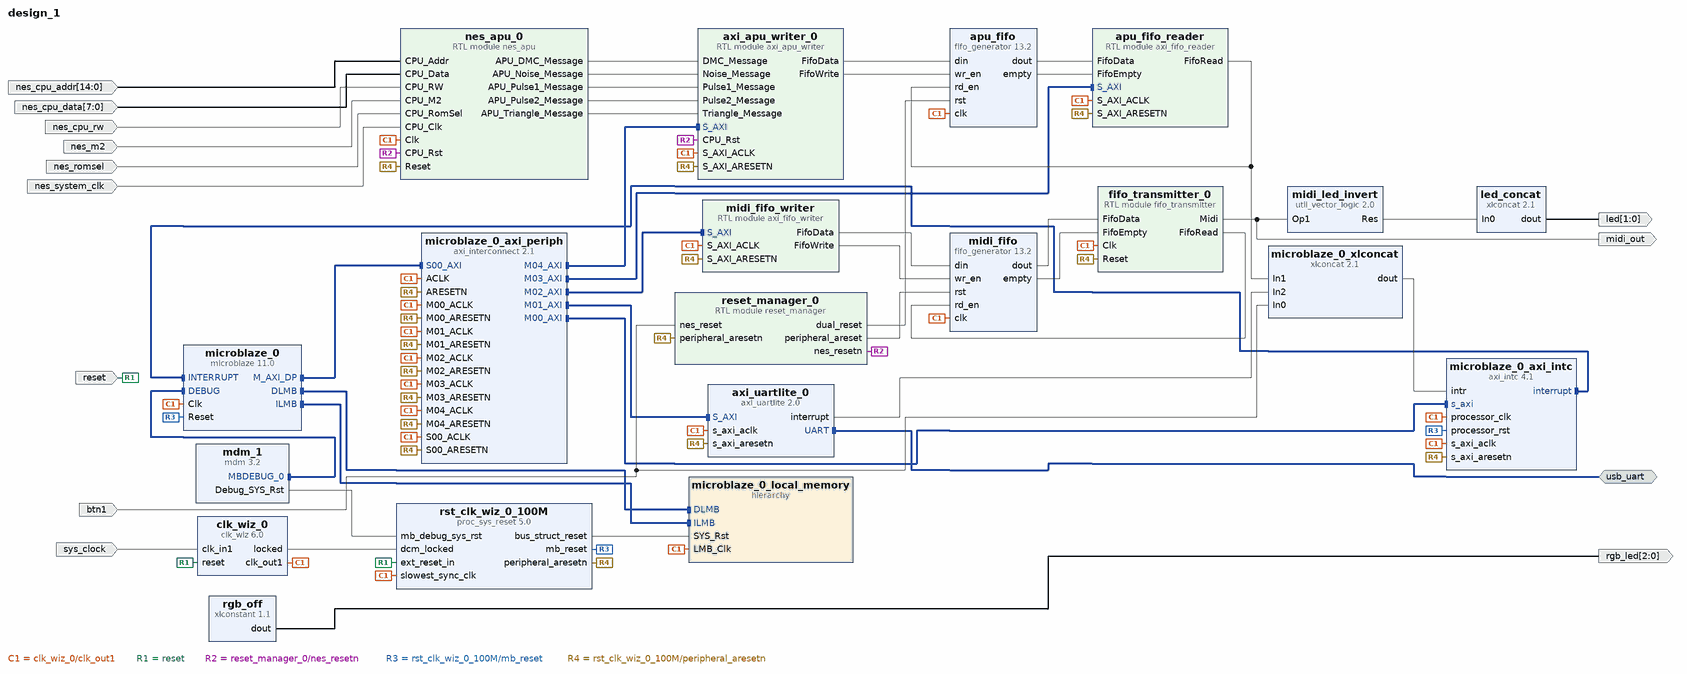
[diagram p0: block diagram of the top level]
# Vivado block design design_1, xc7a35tcpg236-1, Vivado 2022.2.2
create_bd_design design_1

create_bd_intf_port -mode Master -vlnv xilinx.com:interface:uart_rtl:1.0 usb_uart
create_bd_port -dir O -from 2 -to 0 rgb_led
create_bd_port -dir O -from 1 -to 0 led
create_bd_port -dir I -from 14 -to 0 nes_cpu_addr
create_bd_port -dir I -from 7 -to 0 nes_cpu_data
create_bd_port -dir I nes_cpu_rw
create_bd_port -dir I nes_romsel
create_bd_port -dir I -type clk nes_system_clk
set_property -dict {CONFIG.FREQ_HZ 21477272} [get_bd_ports nes_system_clk]
create_bd_port -dir O midi_out
create_bd_port -dir I -type clk nes_m2
set_property -dict {CONFIG.FREQ_HZ 1789773} [get_bd_ports nes_m2]
create_bd_port -dir I btn1
create_bd_port -dir I -type clk sys_clock
set_property -dict {CONFIG.FREQ_HZ 12000000 CONFIG.PHASE 0.0} [get_bd_ports sys_clock]
create_bd_port -dir I -type rst reset
set_property -dict {CONFIG.POLARITY ACTIVE_HIGH} [get_bd_ports reset]

create_bd_cell -type ip -vlnv xilinx.com:ip:xlconstant:1.1 rgb_off
set_property -dict {CONFIG.CONST_VAL 7 CONFIG.CONST_WIDTH 3} [get_bd_cells rgb_off]
create_bd_cell -type ip -vlnv xilinx.com:ip:xlconcat:2.1 led_concat
set_property -dict {CONFIG.IN0_WIDTH 1 CONFIG.IN1_WIDTH 1} [get_bd_cells led_concat]
create_bd_cell -type ip -vlnv xilinx.com:ip:clk_wiz:6.0 clk_wiz_0
set_property -dict [list \
  CONFIG.CLK_IN1_BOARD_INTERFACE sys_clock \
  CONFIG.RESET_BOARD_INTERFACE reset \
  CONFIG.USE_BOARD_FLOW true \
] [get_bd_cells clk_wiz_0]
create_bd_cell -type ip -vlnv xilinx.com:ip:proc_sys_reset:5.0 rst_clk_wiz_0_100M
set_property -dict {CONFIG.RESET_BOARD_INTERFACE reset CONFIG.USE_BOARD_FLOW true} [get_bd_cells rst_clk_wiz_0_100M]
create_bd_cell -type ip -vlnv xilinx.com:ip:util_vector_logic:2.0 midi_led_invert
set_property -dict {CONFIG.C_OPERATION not CONFIG.C_SIZE 1} [get_bd_cells midi_led_invert]
create_bd_cell -type module -reference reset_manager reset_manager_0
create_bd_cell -type module -reference axi_fifo_reader apu_fifo_reader
set_property -dict {CONFIG.FIFO_DATA_WIDTH 28} [get_bd_cells apu_fifo_reader]
create_bd_cell -type ip -vlnv xilinx.com:ip:fifo_generator:13.2 apu_fifo
set_property -dict [list \
  CONFIG.Enable_Safety_Circuit false \
  CONFIG.Input_Data_Width 28 \
  CONFIG.Reset_Type Asynchronous_Reset \
] [get_bd_cells apu_fifo]
create_bd_cell -type ip -vlnv xilinx.com:ip:axi_intc:4.1 microblaze_0_axi_intc
set_property -dict {CONFIG.C_HAS_FAST 1} [get_bd_cells microblaze_0_axi_intc]
create_bd_cell -type ip -vlnv xilinx.com:ip:mdm:3.2 mdm_1
create_bd_cell -type ip -vlnv xilinx.com:ip:microblaze:11.0 microblaze_0
set_property -dict [list \
  CONFIG.C_DEBUG_ENABLED 1 \
  CONFIG.C_D_AXI 1 \
  CONFIG.C_D_LMB 1 \
  CONFIG.C_I_LMB 1 \
  CONFIG.C_USE_DIV 1 \
  CONFIG.C_USE_FPU 1 \
  CONFIG.C_USE_HW_MUL 1 \
] [get_bd_cells microblaze_0]
create_bd_cell -type ip -vlnv xilinx.com:ip:axi_uartlite:2.0 axi_uartlite_0
set_property -dict [list \
  CONFIG.C_BAUDRATE 230400 \
  CONFIG.UARTLITE_BOARD_INTERFACE usb_uart \
  CONFIG.USE_BOARD_FLOW true \
] [get_bd_cells axi_uartlite_0]
create_bd_cell -type ip -vlnv xilinx.com:ip:xlconcat:2.1 microblaze_0_xlconcat
set_property -dict {CONFIG.NUM_PORTS 3} [get_bd_cells microblaze_0_xlconcat]
create_bd_cell -type ip -vlnv xilinx.com:ip:axi_interconnect:2.1 microblaze_0_axi_periph
set_property -dict {CONFIG.NUM_MI 5} [get_bd_cells microblaze_0_axi_periph]
create_bd_cell -type hier microblaze_0_local_memory
create_bd_cell -type module -reference axi_fifo_writer midi_fifo_writer
set_property -dict {CONFIG.FIFO_DATA_WIDTH 26} [get_bd_cells midi_fifo_writer]
create_bd_cell -type ip -vlnv xilinx.com:ip:fifo_generator:13.2 midi_fifo
set_property -dict [list \
  CONFIG.Data_Count false \
  CONFIG.Enable_Safety_Circuit false \
  CONFIG.Input_Data_Width 26 \
  CONFIG.Reset_Type Asynchronous_Reset \
  CONFIG.Use_Embedded_Registers false \
  CONFIG.Write_Acknowledge_Flag false \
] [get_bd_cells midi_fifo]
create_bd_cell -type module -reference fifo_transmitter fifo_transmitter_0
create_bd_cell -type module -reference axi_apu_writer axi_apu_writer_0
set_property -dict [list \
  CONFIG.DEFAULT_DMC false \
  CONFIG.DEFAULT_NOISE true \
  CONFIG.DEFAULT_PULSE_1 true \
  CONFIG.FIFO_DATA_WIDTH 28 \
] [get_bd_cells axi_apu_writer_0]
create_bd_cell -type module -reference nes_apu nes_apu_0

# ---- hierarchy /microblaze_0_local_memory ----
current_bd_instance /microblaze_0_local_memory
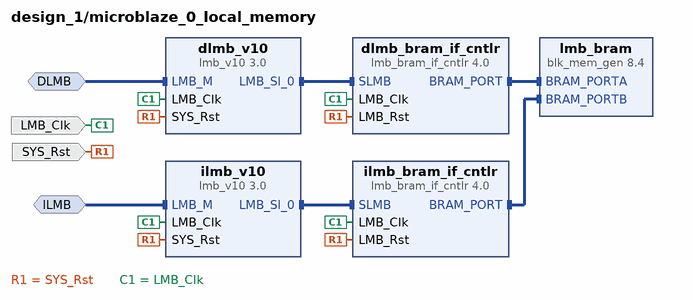
[diagram p1: block diagram inside /microblaze_0_local_memory]
create_bd_intf_pin -mode MirroredMaster -vlnv xilinx.com:interface:lmb_rtl:1.0 DLMB
create_bd_intf_pin -mode MirroredMaster -vlnv xilinx.com:interface:lmb_rtl:1.0 ILMB
create_bd_pin -dir I -type clk LMB_Clk
create_bd_pin -dir I -type rst SYS_Rst

create_bd_cell -type ip -vlnv xilinx.com:ip:lmb_v10:3.0 dlmb_v10
create_bd_cell -type ip -vlnv xilinx.com:ip:lmb_v10:3.0 ilmb_v10
create_bd_cell -type ip -vlnv xilinx.com:ip:lmb_bram_if_cntlr:4.0 dlmb_bram_if_cntlr
set_property -dict {CONFIG.C_ECC 0} [get_bd_cells dlmb_bram_if_cntlr]
create_bd_cell -type ip -vlnv xilinx.com:ip:lmb_bram_if_cntlr:4.0 ilmb_bram_if_cntlr
set_property -dict {CONFIG.C_ECC 0} [get_bd_cells ilmb_bram_if_cntlr]
create_bd_cell -type ip -vlnv xilinx.com:ip:blk_mem_gen:8.4 lmb_bram
set_property -dict {CONFIG.Memory_Type True_Dual_Port_RAM CONFIG.use_bram_block BRAM_Controller} [get_bd_cells lmb_bram]

# ---- connections ----

current_bd_instance /microblaze_0_local_memory
connect_bd_intf_net -intf_net microblaze_0_dlmb [get_bd_intf_pins DLMB] [get_bd_intf_pins dlmb_v10/LMB_M]
connect_bd_intf_net -intf_net microblaze_0_dlmb_bus [get_bd_intf_pins dlmb_v10/LMB_Sl_0] [get_bd_intf_pins dlmb_bram_if_cntlr/SLMB]
connect_bd_intf_net -intf_net microblaze_0_dlmb_cntlr [get_bd_intf_pins dlmb_bram_if_cntlr/BRAM_PORT] [get_bd_intf_pins lmb_bram/BRAM_PORTA]
connect_bd_intf_net -intf_net microblaze_0_ilmb [get_bd_intf_pins ILMB] [get_bd_intf_pins ilmb_v10/LMB_M]
connect_bd_intf_net -intf_net microblaze_0_ilmb_bus [get_bd_intf_pins ilmb_v10/LMB_Sl_0] [get_bd_intf_pins ilmb_bram_if_cntlr/SLMB]
connect_bd_intf_net -intf_net microblaze_0_ilmb_cntlr [get_bd_intf_pins ilmb_bram_if_cntlr/BRAM_PORT] [get_bd_intf_pins lmb_bram/BRAM_PORTB]
connect_bd_net [get_bd_pins SYS_Rst] \
  [get_bd_pins dlmb_v10/SYS_Rst] [get_bd_pins dlmb_bram_if_cntlr/LMB_Rst] [get_bd_pins ilmb_v10/SYS_Rst] \
  [get_bd_pins ilmb_bram_if_cntlr/LMB_Rst]
connect_bd_net -net microblaze_0_Clk [get_bd_pins LMB_Clk] \
  [get_bd_pins dlmb_v10/LMB_Clk] [get_bd_pins dlmb_bram_if_cntlr/LMB_Clk] [get_bd_pins ilmb_v10/LMB_Clk] \
  [get_bd_pins ilmb_bram_if_cntlr/LMB_Clk]
set_property HDL_ATTRIBUTE.BMM_INFO_ADDRESS_SPACE {byte  0x00000000 32 > design_1 microblaze_0_local_memory/lmb_bram} [get_bd_cells dlmb_bram_if_cntlr]
set_property HDL_ATTRIBUTE.KEEP_HIERARCHY yes [get_bd_cells dlmb_bram_if_cntlr]

current_bd_instance /
connect_bd_intf_net [get_bd_intf_ports usb_uart] [get_bd_intf_pins axi_uartlite_0/UART]
connect_bd_intf_net -intf_net microblaze_0_axi_dp [get_bd_intf_pins microblaze_0_axi_periph/S00_AXI] [get_bd_intf_pins microblaze_0/M_AXI_DP]
connect_bd_intf_net [get_bd_intf_pins microblaze_0_axi_periph/M01_AXI] [get_bd_intf_pins axi_uartlite_0/S_AXI]
connect_bd_intf_net [get_bd_intf_pins microblaze_0_axi_periph/M02_AXI] [get_bd_intf_pins midi_fifo_writer/S_AXI]
connect_bd_intf_net [get_bd_intf_pins microblaze_0_axi_periph/M03_AXI] [get_bd_intf_pins apu_fifo_reader/S_AXI]
connect_bd_intf_net [get_bd_intf_pins microblaze_0_axi_periph/M04_AXI] [get_bd_intf_pins axi_apu_writer_0/S_AXI]
connect_bd_intf_net [get_bd_intf_pins mdm_1/MBDEBUG_0] [get_bd_intf_pins microblaze_0/DEBUG]
connect_bd_intf_net [get_bd_intf_pins microblaze_0/DLMB] [get_bd_intf_pins microblaze_0_local_memory/DLMB]
connect_bd_intf_net [get_bd_intf_pins microblaze_0/ILMB] [get_bd_intf_pins microblaze_0_local_memory/ILMB]
connect_bd_intf_net -intf_net microblaze_0_intc_axi [get_bd_intf_pins microblaze_0_axi_periph/M00_AXI] [get_bd_intf_pins microblaze_0_axi_intc/s_axi]
connect_bd_intf_net [get_bd_intf_pins microblaze_0_axi_intc/interrupt] [get_bd_intf_pins microblaze_0/INTERRUPT]
connect_bd_net [get_bd_pins apu_fifo/dout] [get_bd_pins apu_fifo_reader/FifoData]
connect_bd_net [get_bd_pins apu_fifo/empty] [get_bd_pins apu_fifo_reader/FifoEmpty]
connect_bd_net [get_bd_pins apu_fifo_reader/FifoRead] [get_bd_pins apu_fifo/rd_en] [get_bd_pins microblaze_0_xlconcat/In1]
connect_bd_net [get_bd_pins axi_apu_writer_0/FifoData] [get_bd_pins apu_fifo/din]
connect_bd_net [get_bd_pins axi_apu_writer_0/FifoWrite] [get_bd_pins apu_fifo/wr_en]
connect_bd_net -net axi_fifo_writer_0_FifoData [get_bd_pins midi_fifo_writer/FifoData] [get_bd_pins midi_fifo/din]
connect_bd_net -net axi_fifo_writer_0_FifoWrite [get_bd_pins midi_fifo_writer/FifoWrite] [get_bd_pins midi_fifo/wr_en]
connect_bd_net [get_bd_pins axi_uartlite_0/interrupt] [get_bd_pins microblaze_0_xlconcat/In2]
connect_bd_net -net btn1_1 [get_bd_ports btn1] [get_bd_pins reset_manager_0/nes_reset] [get_bd_pins microblaze_0_xlconcat/In0]
connect_bd_net [get_bd_pins clk_wiz_0/locked] [get_bd_pins rst_clk_wiz_0_100M/dcm_locked]
connect_bd_net -net fifo_generator_0_dout [get_bd_pins midi_fifo/dout] [get_bd_pins fifo_transmitter_0/FifoData]
connect_bd_net -net fifo_generator_0_empty [get_bd_pins midi_fifo/empty] [get_bd_pins fifo_transmitter_0/FifoEmpty]
connect_bd_net [get_bd_pins fifo_transmitter_0/FifoRead] [get_bd_pins midi_fifo/rd_en]
connect_bd_net [get_bd_pins fifo_transmitter_0/Midi] [get_bd_ports midi_out] [get_bd_pins midi_led_invert/Op1]
connect_bd_net [get_bd_pins mdm_1/Debug_SYS_Rst] [get_bd_pins rst_clk_wiz_0_100M/mb_debug_sys_rst]
connect_bd_net -net microblaze_0_Clk [get_bd_pins clk_wiz_0/clk_out1] \
  [get_bd_pins rst_clk_wiz_0_100M/slowest_sync_clk] [get_bd_pins apu_fifo/clk] [get_bd_pins apu_fifo_reader/S_AXI_ACLK] \
  [get_bd_pins axi_uartlite_0/s_axi_aclk] [get_bd_pins microblaze_0_axi_periph/M03_ACLK] \
  [get_bd_pins microblaze_0_axi_periph/M02_ACLK] [get_bd_pins microblaze_0_axi_periph/M01_ACLK] \
  [get_bd_pins microblaze_0_local_memory/LMB_Clk] [get_bd_pins microblaze_0_axi_intc/processor_clk] \
  [get_bd_pins microblaze_0_axi_periph/M00_ACLK] [get_bd_pins microblaze_0_axi_periph/S00_ACLK] \
  [get_bd_pins microblaze_0_axi_periph/ACLK] [get_bd_pins microblaze_0/Clk] [get_bd_pins microblaze_0_axi_intc/s_axi_aclk] \
  [get_bd_pins midi_fifo/clk] [get_bd_pins fifo_transmitter_0/Clk] [get_bd_pins midi_fifo_writer/S_AXI_ACLK] \
  [get_bd_pins microblaze_0_axi_periph/M04_ACLK] [get_bd_pins axi_apu_writer_0/S_AXI_ACLK] [get_bd_pins nes_apu_0/Clk]
connect_bd_net -net microblaze_0_intr [get_bd_pins microblaze_0_xlconcat/dout] [get_bd_pins microblaze_0_axi_intc/intr]
connect_bd_net [get_bd_pins nes_apu_0/APU_DMC_Message] [get_bd_pins axi_apu_writer_0/DMC_Message]
connect_bd_net [get_bd_pins nes_apu_0/APU_Noise_Message] [get_bd_pins axi_apu_writer_0/Noise_Message]
connect_bd_net [get_bd_pins nes_apu_0/APU_Pulse1_Message] [get_bd_pins axi_apu_writer_0/Pulse1_Message]
connect_bd_net [get_bd_pins nes_apu_0/APU_Pulse2_Message] [get_bd_pins axi_apu_writer_0/Pulse2_Message]
connect_bd_net [get_bd_pins nes_apu_0/APU_Triangle_Message] [get_bd_pins axi_apu_writer_0/Triangle_Message]
connect_bd_net [get_bd_ports nes_cpu_addr] [get_bd_pins nes_apu_0/CPU_Addr]
connect_bd_net [get_bd_ports nes_cpu_data] [get_bd_pins nes_apu_0/CPU_Data]
connect_bd_net [get_bd_ports nes_cpu_rw] [get_bd_pins nes_apu_0/CPU_RW]
connect_bd_net -net nes_m2_1 [get_bd_ports nes_m2] [get_bd_pins nes_apu_0/CPU_M2]
connect_bd_net [get_bd_ports nes_romsel] [get_bd_pins nes_apu_0/CPU_RomSel]
connect_bd_net [get_bd_ports nes_system_clk] [get_bd_pins nes_apu_0/CPU_Clk]
connect_bd_net [get_bd_ports reset] [get_bd_pins clk_wiz_0/reset] [get_bd_pins rst_clk_wiz_0_100M/ext_reset_in]
connect_bd_net [get_bd_pins reset_manager_0/dual_reset] [get_bd_pins apu_fifo/rst]
connect_bd_net [get_bd_pins reset_manager_0/nes_resetn] [get_bd_pins axi_apu_writer_0/CPU_Rst] [get_bd_pins nes_apu_0/CPU_Rst]
connect_bd_net [get_bd_pins reset_manager_0/peripheral_areset] [get_bd_pins midi_fifo/rst]
connect_bd_net [get_bd_pins rgb_off/dout] [get_bd_ports rgb_led]
connect_bd_net [get_bd_pins rst_clk_wiz_0_100M/bus_struct_reset] [get_bd_pins microblaze_0_local_memory/SYS_Rst]
connect_bd_net [get_bd_pins rst_clk_wiz_0_100M/mb_reset] [get_bd_pins microblaze_0/Reset] [get_bd_pins microblaze_0_axi_intc/processor_rst]
connect_bd_net [get_bd_pins rst_clk_wiz_0_100M/peripheral_aresetn] \
  [get_bd_pins reset_manager_0/peripheral_aresetn] [get_bd_pins apu_fifo_reader/S_AXI_ARESETN] \
  [get_bd_pins axi_uartlite_0/s_axi_aresetn] [get_bd_pins microblaze_0_axi_periph/M03_ARESETN] \
  [get_bd_pins microblaze_0_axi_periph/M02_ARESETN] [get_bd_pins microblaze_0_axi_periph/M01_ARESETN] \
  [get_bd_pins microblaze_0_axi_periph/M00_ARESETN] [get_bd_pins microblaze_0_axi_periph/S00_ARESETN] \
  [get_bd_pins microblaze_0_axi_periph/ARESETN] [get_bd_pins microblaze_0_axi_intc/s_axi_aresetn] \
  [get_bd_pins fifo_transmitter_0/Reset] [get_bd_pins midi_fifo_writer/S_AXI_ARESETN] \
  [get_bd_pins microblaze_0_axi_periph/M04_ARESETN] [get_bd_pins axi_apu_writer_0/S_AXI_ARESETN] \
  [get_bd_pins nes_apu_0/Reset]
connect_bd_net [get_bd_ports sys_clock] [get_bd_pins clk_wiz_0/clk_in1]
connect_bd_net -net util_vector_logic_0_Res1 [get_bd_pins midi_led_invert/Res] [get_bd_pins led_concat/In0]
connect_bd_net -net xlconcat_0_dout [get_bd_pins led_concat/dout] [get_bd_ports led]
set_property HDL_ATTRIBUTE.BMM_INFO_PROCESSOR {microblaze-le > design_1 microblaze_0_local_memory/dlmb_bram_if_cntlr} [get_bd_cells microblaze_0]
set_property HDL_ATTRIBUTE.KEEP_HIERARCHY yes [get_bd_cells microblaze_0]

# ---- address map ----
assign_bd_address -offset 0x00000000 -range 64K -target_address_space [get_bd_addr_spaces microblaze_0/Data] [get_bd_addr_segs microblaze_0_local_memory/dlmb_bram_if_cntlr/SLMB/Mem]
assign_bd_address -offset 0x00010000 -range 4K -target_address_space [get_bd_addr_spaces microblaze_0/Data] [get_bd_addr_segs midi_fifo_writer/S_AXI/reg0]
assign_bd_address -offset 0x00011000 -range 4K -target_address_space [get_bd_addr_spaces microblaze_0/Data] [get_bd_addr_segs axi_apu_writer_0/S_AXI/reg0]
assign_bd_address -offset 0x00020000 -range 4K -target_address_space [get_bd_addr_spaces microblaze_0/Data] [get_bd_addr_segs apu_fifo_reader/S_AXI/reg0]
assign_bd_address -offset 0x40600000 -range 64K -target_address_space [get_bd_addr_spaces microblaze_0/Data] [get_bd_addr_segs axi_uartlite_0/S_AXI/Reg]
assign_bd_address -offset 0x41200000 -range 64K -target_address_space [get_bd_addr_spaces microblaze_0/Data] [get_bd_addr_segs microblaze_0_axi_intc/S_AXI/Reg]
assign_bd_address -offset 0x00000000 -range 64K -target_address_space [get_bd_addr_spaces microblaze_0/Instruction] [get_bd_addr_segs microblaze_0_local_memory/ilmb_bram_if_cntlr/SLMB/Mem]

validate_bd_design
save_bd_design
